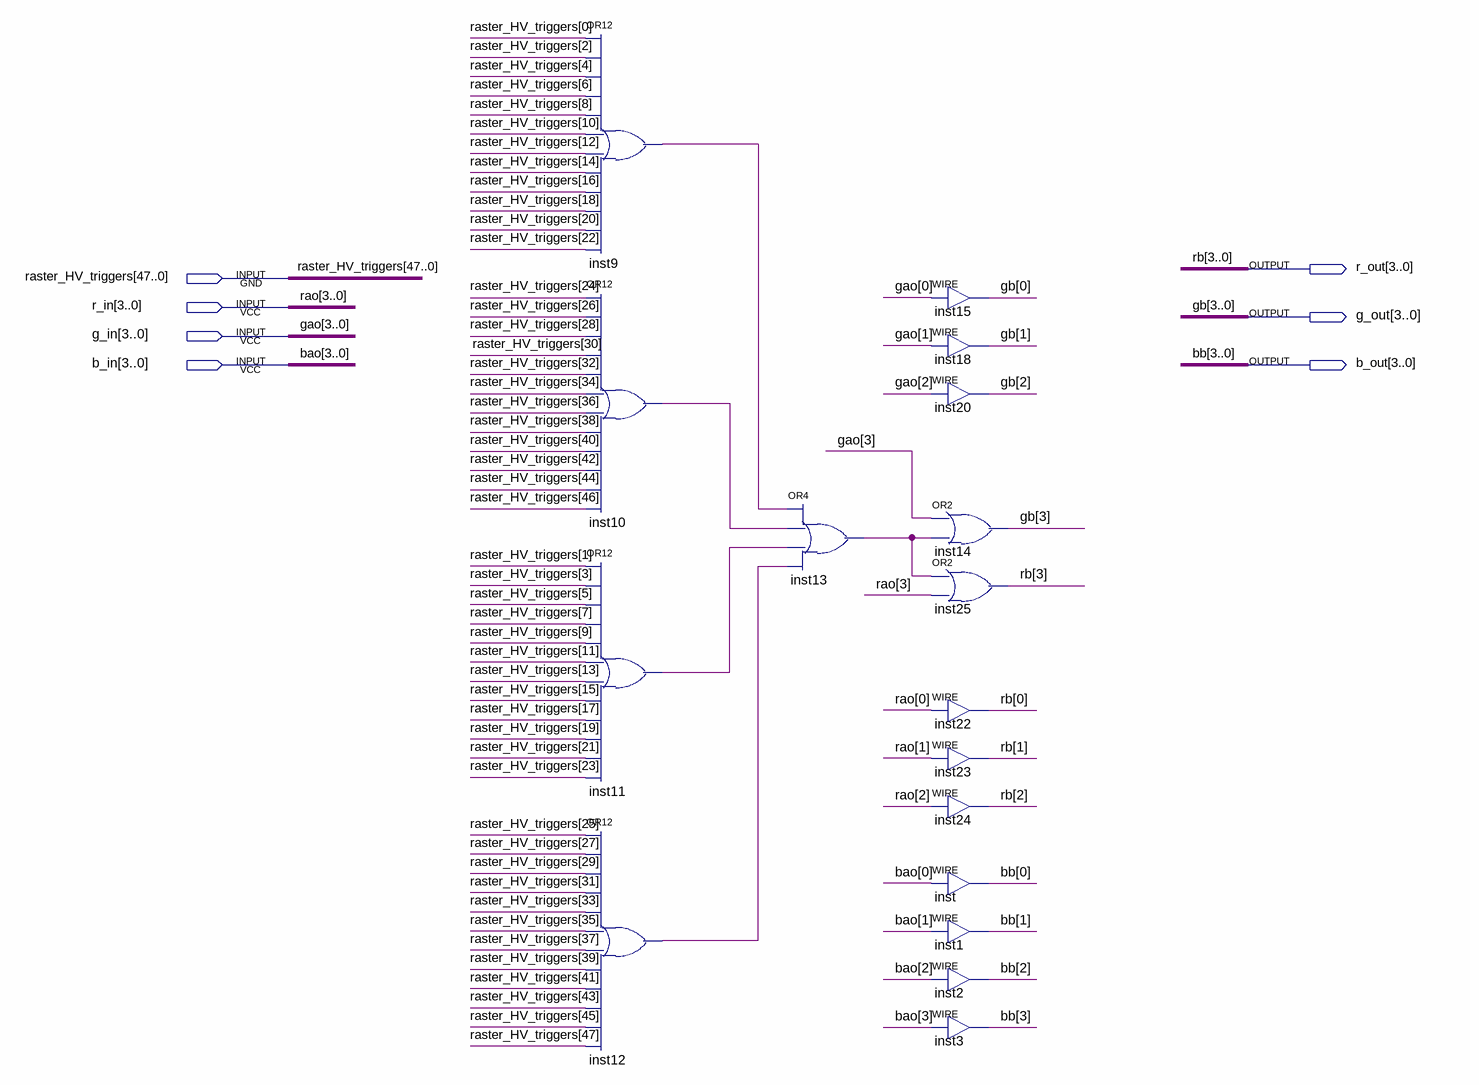
[diagram p0: schematic sheet]
// Quartus schematic raster_trigger_mux.bdf as structural Verilog: 17 symbols, 7 pins
module raster_trigger_mux (
  input  [47:0] raster_HV_triggers,
  input  [3:0] r_in,
  input  [3:0] g_in,
  input  [3:0] b_in,
  output [3:0] r_out,
  output [3:0] g_out,
  output [3:0] b_out
);

  wire inst9_out, inst10_out, inst11_out, inst12_out, inst13_out;

  or inst9 (inst9_out, raster_HV_triggers[0], raster_HV_triggers[2], raster_HV_triggers[4], raster_HV_triggers[6], raster_HV_triggers[8], raster_HV_triggers[10], raster_HV_triggers[12], raster_HV_triggers[14], raster_HV_triggers[16], raster_HV_triggers[18], raster_HV_triggers[20], raster_HV_triggers[22]);
  or inst10 (inst10_out, raster_HV_triggers[24], raster_HV_triggers[26], raster_HV_triggers[28], raster_HV_triggers[30], raster_HV_triggers[32], raster_HV_triggers[34], raster_HV_triggers[36], raster_HV_triggers[38], raster_HV_triggers[40], raster_HV_triggers[42], raster_HV_triggers[44], raster_HV_triggers[46]);
  or inst11 (inst11_out, raster_HV_triggers[1], raster_HV_triggers[3], raster_HV_triggers[5], raster_HV_triggers[7], raster_HV_triggers[9], raster_HV_triggers[11], raster_HV_triggers[13], raster_HV_triggers[15], raster_HV_triggers[17], raster_HV_triggers[19], raster_HV_triggers[21], raster_HV_triggers[23]);
  or inst12 (inst12_out, raster_HV_triggers[25], raster_HV_triggers[27], raster_HV_triggers[29], raster_HV_triggers[31], raster_HV_triggers[33], raster_HV_triggers[35], raster_HV_triggers[37], raster_HV_triggers[39], raster_HV_triggers[41], raster_HV_triggers[43], raster_HV_triggers[45], raster_HV_triggers[47]);
  or inst13 (inst13_out, inst9_out, inst10_out, inst11_out, inst12_out);
  assign g_out[0] = g_in[0];  // WIRE inst15
  assign g_out[1] = g_in[1];  // WIRE inst18
  assign g_out[2] = g_in[2];  // WIRE inst20
  or inst14 (g_out[3], g_in[3], inst13_out);
  or inst25 (r_out[3], inst13_out, r_in[3]);
  assign r_out[0] = r_in[0];  // WIRE inst22
  assign r_out[1] = r_in[1];  // WIRE inst23
  assign r_out[2] = r_in[2];  // WIRE inst24
  assign b_out[0] = b_in[0];  // WIRE inst
  assign b_out[1] = b_in[1];  // WIRE inst1
  assign b_out[2] = b_in[2];  // WIRE inst2
  assign b_out[3] = b_in[3];  // WIRE inst3

  // Other names for the same wires on the sheet: bao[3:0] = b_in; bb[3:0] = b_out; gao[3:0] = g_in; gb[3:0] = g_out;
  //   rao[3:0] = r_in; rb[3:0] = r_out
endmodule
